# EAGLE design wireless_haptics (EAGLE 6.5.0)
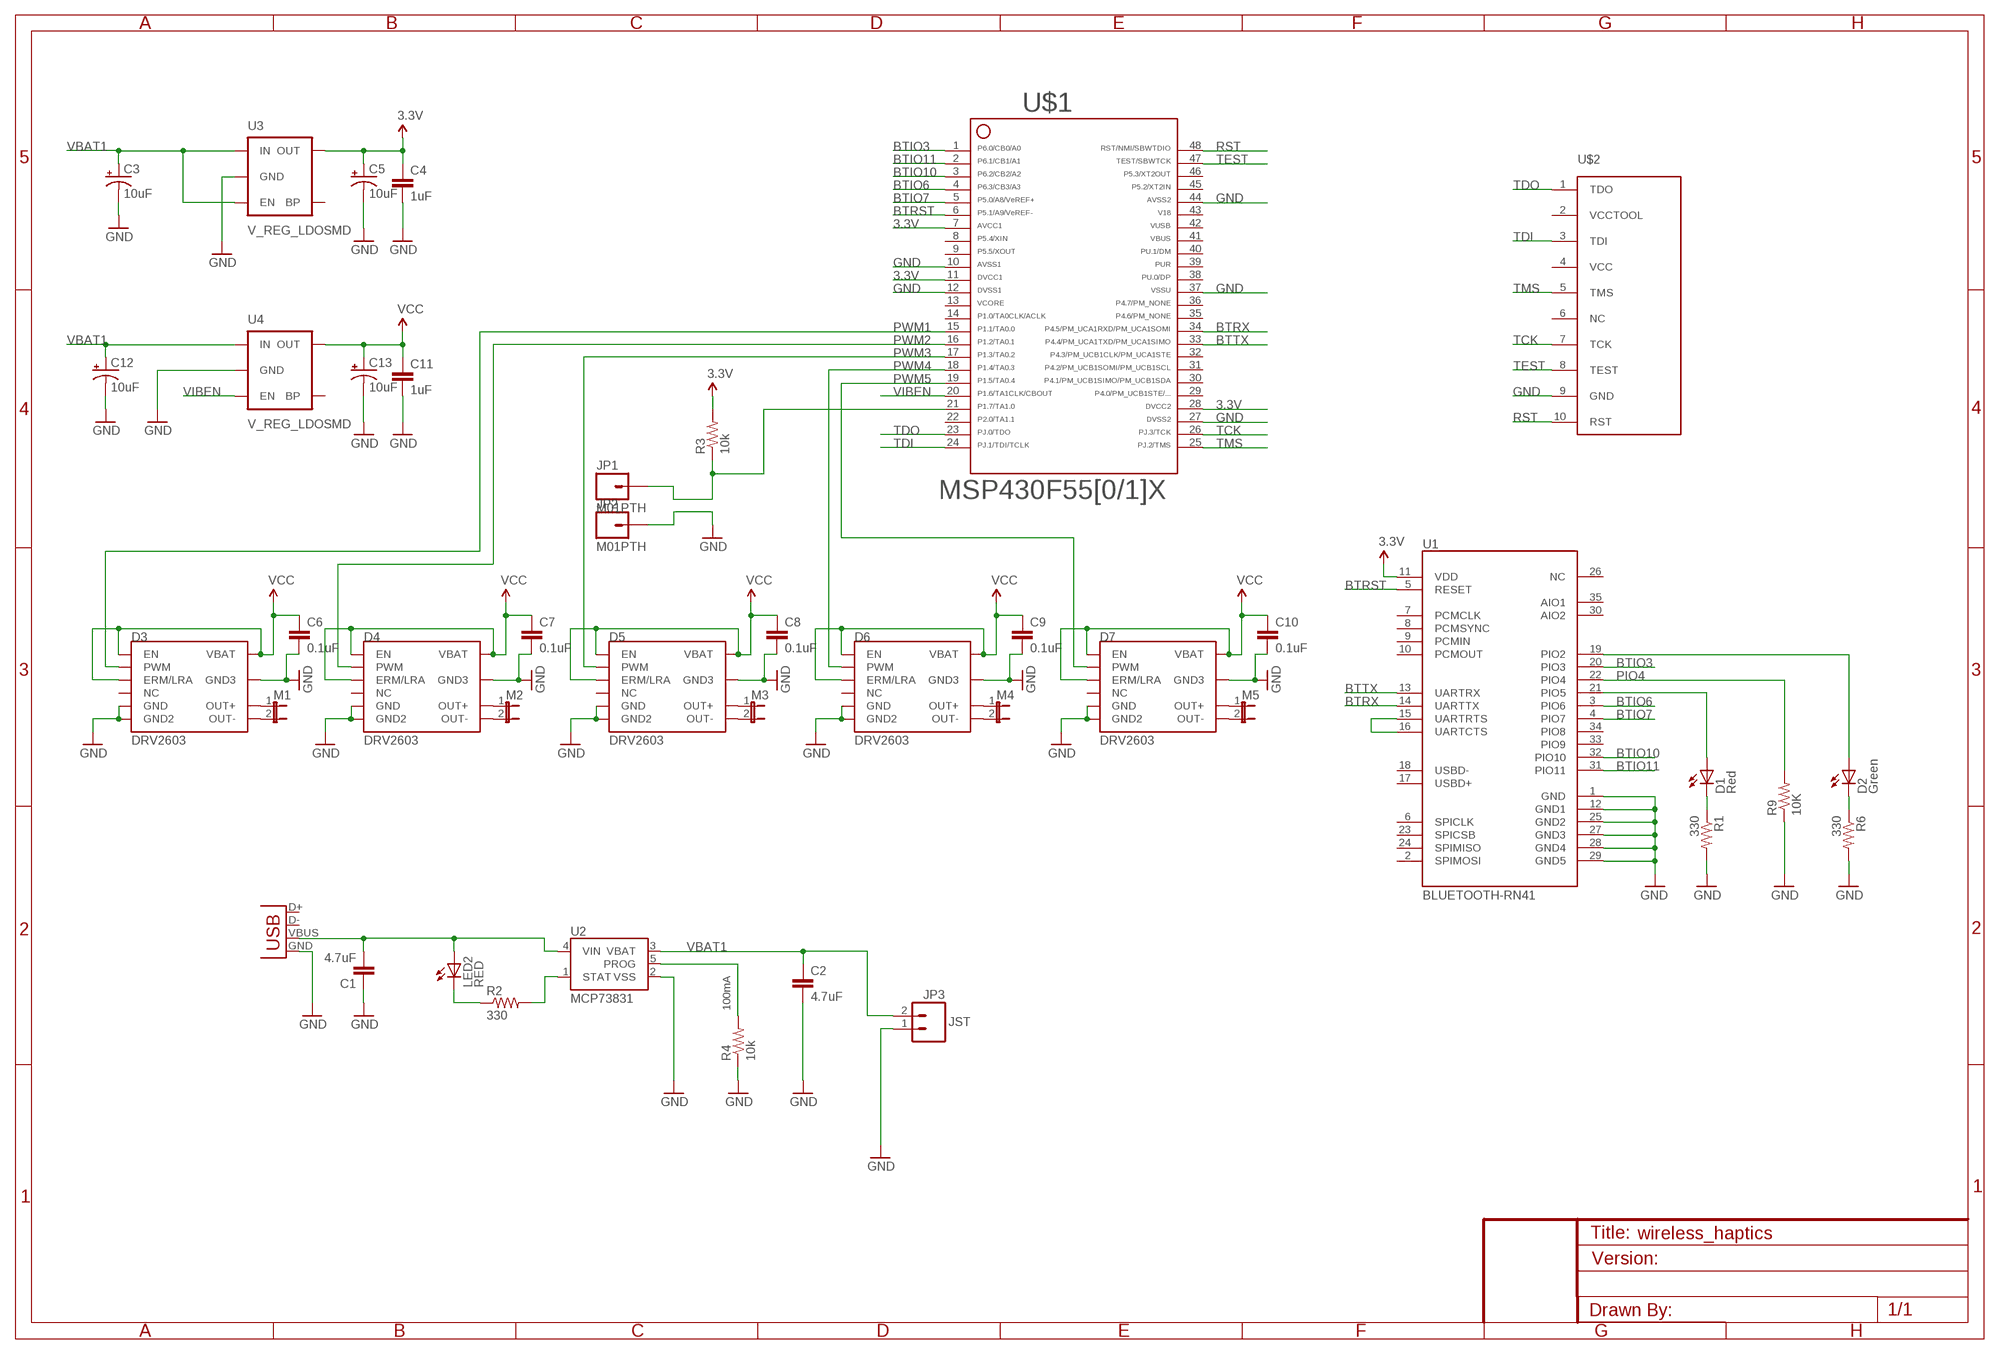
[diagram p0: schematic, sheet 1]

## Parts
C1  4.7uF  CAP0402-CAP  [0402-CAP]
C2  4.7uF  CAP0402-CAP  [0402-CAP]
C3  10uF  CAP_POL1206  [EIA3216]
C4  1uF  CAP0402-CAP  [0402-CAP]
C5  10uF  CAP_POL1206  [EIA3216]
C6  0.1uF  CAP0805  [0805]
C7  0.1uF  CAP0805  [0805]
C8  0.1uF  CAP0805  [0805]
C9  0.1uF  CAP0805  [0805]
C10  0.1uF  CAP0805  [0805]
C11  1uF  CAP0402-CAP  [0402-CAP]
C12  10uF  CAP_POL1206  [EIA3216]
C13  10uF  CAP_POL1206  [EIA3216]
D1  Red  LED0603  [LED-0603]
D2  Green  LED0603  [LED-0603]
D3  DRV2603  [QFN]
D4  DRV2603  [QFN]
D5  DRV2603  [QFN]
D6  DRV2603  [QFN]
D7  DRV2603  [QFN]
JP1  M01PTH  [1X01]
JP2  M01PTH  [1X01]
JP3  JST  M02JST-PTH-2  [JST-2-PTH]
LED2  RED  LED0603  [LED-0603]
M1  JUMPER-2PTH  [1X02]
M2  JUMPER-2PTH  [1X02]
M3  JUMPER-2PTH  [1X02]
M4  JUMPER-2PTH  [1X02]
M5  JUMPER-2PTH  [1X02]
R1  330  RESISTOR0402-RES  [0402-RES]
R2  330  RESISTOR0402-RES  [0402-RES]
R3  10k  RESISTOR0402-RES  [0402-RES]
R4  10k  RESISTOR0402-RES  [0402-RES]
R6  330  RESISTOR0402-RES  [0402-RES]
R9  10K  RESISTOR0402-RES  [0402-RES]
U1  BLUETOOTH-RN41  BLUETOOTH-RN41"  [RN41]
U2  MCP73831  [SOT23-5]
U3  V_REG_LDOSMD  [SOT23-5]
U4  V_REG_LDOSMD  [SOT23-5]
U$1  F55[0/1]X---PT48  [PT48]
U$2  TC2050-NL-MCP-NL  [TC2030-MCP-NL]
X1  USBSMD  [USB-MINIB]

## Nets
3.3V: C4.1 C5.A(+) U1.11(VDD) U3.5(OUT) U$1.7 U$1.11 U$1.28
BTIO3: U1.20(PIO3) U$1.1
BTIO6: U1.3(PIO6) U$1.4
BTIO7: U1.4(PIO7) U$1.5
BTIO10: U1.32(PIO10) U$1.3
BTIO11: U1.31(PIO11) U$1.2
BTRST: U1.5(RESET) U$1.6
BTRX: U1.14(UARTTX) U$1.34
BTTX: U1.13(UARTRX) U$1.33
D1: D1.C R1.1
D2: D2.C R6.1
GND: C1.1 C2.2 C3.C(-) C4.2 C5.C(-) C6.2 C7.2 C8.2 C9.2 C10.2 C11.2 C12.C(-) C13.C(-) D3.P$5(GND) D3.P$8(GND2) D3.P$10(GND3) D4.P$5(GND) D4.P$8(GND2) D4.P$10(GND3) D5.P$5(GND) D5.P$8(GND2) D5.P$10(GND3) D6.P$5(GND) D6.P$8(GND2) D6.P$10(GND3) D7.P$5(GND) D7.P$8(GND2) D7.P$10(GND3) JP2.1 JP3.1 R1.2 R4.1 R6.2 R9.1 U1.1(GND) U1.12(GND1) U1.25(GND2) U1.27(GND3) U1.28(GND4) U1.29(GND5) U2.2(VSS) U3.2(GND) U4.2(GND) U$1.10 U$1.12 U$1.27 U$1.37 U$1.44 U$2.9(GND) X1.GND
N$1: D1.A U1.21(PIO5)
N$2: D2.A U1.19(PIO2)
N$3: C1.2 LED2.A U2.4(VIN) X1.VBUS
N$4: D6.P$6(OUT+) M4.1
N$5: R2.2 U2.1(STAT)
N$6: LED2.C R2.1
N$7: D6.P$9(OUT-) M4.2
N$8: D7.P$6(OUT+) M5.1
N$9: D7.P$9(OUT-) M5.2
N$10: D5.P$6(OUT+) M3.1
N$11: D5.P$9(OUT-) M3.2
N$12: D4.P$6(OUT+) M2.1
N$13: D4.P$9(OUT-) M2.2
N$14: D3.P$6(OUT+) M1.1
N$15: D3.P$9(OUT-) M1.2
N$16: U1.15(UARTRTS) U1.16(UARTCTS)
N$18: JP1.1 R3.1 U$1.21
PIO4: R9.2 U1.22(PIO4)
PROG: R4.2 U2.5(PROG)
PWM1: D3.P$2(PWM) U$1.15
PWM2: D4.P$2(PWM) U$1.16
PWM3: D5.P$2(PWM) U$1.17
PWM4: D6.P$2(PWM) U$1.18
PWM5: D7.P$2(PWM) U$1.19
RST: U$1.48 U$2.10(RST)
TCK: U$1.26 U$2.7(TCK)
TDI: U$1.24 U$2.3(TDI)
TDO: U$1.23 U$2.1(TDO)
TEST: U$1.47 U$2.8(TEST)
TMS: U$1.25 U$2.5(TMS)
VBAT1: C2.1 C3.A(+) C12.A(+) JP3.2 U2.3(VBAT) U3.1(IN) U3.3(EN) U4.1(IN)
VCC: C6.1 C7.1 C8.1 C9.1 C10.1 C11.1 C13.A(+) D3.P$1(EN) D3.P$3(ERM/LRA) D3.P$7(VBAT) D4.P$1(EN) D4.P$3(ERM/LRA) D4.P$7(VBAT) D5.P$1(EN) D5.P$3(ERM/LRA) D5.P$7(VBAT) D6.P$1(EN) D6.P$3(ERM/LRA) D6.P$7(VBAT) D7.P$1(EN) D7.P$3(ERM/LRA) D7.P$7(VBAT) R3.2 U4.5(OUT) ; supply symbol labelled 3.3V
VIBEN: U4.3(EN) U$1.20
Unconnected: D3.P$4(NC) D4.P$4(NC) D5.P$4(NC) D6.P$4(NC) D7.P$4(NC) U1.2(SPIMOSI) U1.6(SPICLK) U1.7(PCMCLK) U1.8(PCMSYNC) U1.9(PCMIN) U1.10(PCMOUT) U1.17(USBD+) U1.18(USBD-) U1.23(SPICSB) U1.24(SPIMISO) U1.26(NC) U1.30(AIO2) U1.33(PIO9) U1.34(PIO8) U1.35(AIO1) U3.4(BP) U4.4(BP) U$1.8 U$1.9 U$1.14 U$1.22 U$1.29 U$1.30 U$1.31 U$1.32 U$1.35 U$1.36 U$1.38 U$1.39 U$1.40 U$1.45 U$2.2(VCCTOOL) U$2.4(VCC) U$2.6(NC) X1.D+ X1.D-

## Notes on the sheet
- 100mA

## Power pins joined to a net without a drawn wire
13: U$1.13
41: U$1.41
42: U$1.42
43: U$1.43
46: U$1.46

## Library data of the parts
C1 C2 C4 C6-C11 = SparkFun:CAP: Capacitor Standard 0603 ceramic capacitor, and 0.1" leaded capacitor.
C3 C5 C12 C13 = SparkFun:CAP_POL: Capacitor Polarized These are standard SMD and PTH capacitors. Normally 10uF, 47uF, and 100uF in electrolytic and tantalum varieties. Always verify the external diameter of the through hole cap, it varies with capacity, voltage, and manufacturer. The EIA devices should be standard.
D1 D2 LED2 = SparkFun:LED: LEDs Standard schematic elements and footprints for 5mm, 3mm, 1206, and 0603 sized LEDs. 5mm - Spark Fun Electronics SKU : COM-00529 (and others)
D3-D7 = drv10:DRV2603
JP1 JP2 = SparkFun-Connectors:M01: Header 1 Standard 1-pin 0.1" header. Use with straight break away headers (SKU : PRT-00116), right angle break away headers (PRT-00553), swiss pins (PRT-00743), machine pins (PRT-00117), and female headers (PRT-00115).
JP3 = SparkFun:M02: Header 2 Standard 2-pin 0.1" header. Use with straight break away headers (SKU : PRT-00116), right angle break away headers (PRT-00553), swiss pins (PRT-00743), machine pins (PRT-00117), and female headers (PRT-00115). Molex polarized connector foot print use with SKU : PRT-08233 with associated crimp pins and housings.
M1-M5 = SparkFun:JUMPER-2: Jumper Basic 0.1" spaced jumper. Use with breakaway headers.
R1-R4 R6 R9 = SparkFun:RESISTOR: Resistor Basic schematic elements and footprints for 0603, 1206, and PTH resistors.
U1 = ScratchPad:BLUETOOTH-RN41
U2 = SparkFun:MCP73831: Microchip's MCP73831 Miniature single cell, fully integrated Li-Ion, Li-polymer charge management controller http://ww1.microchip.com/downloads/en/DeviceDoc/21984a.pdf
U3 U4 = SparkFun:V_REG_LDO: Voltage Regulator LDO Standard 150mA LDO voltage regulator in SOT-23 layout. Micrel part MIC5205. BP (by-pass) pin is used to lower output noise with 470pF cap.
U$1 = MSP430-Eagle-Library:F55[0/1]X---PT48: ***F55[0/1/2]X*** PT48 Rev. 1.0 06/2010 "http://www.ti.com/lit/gpn/msp430f5509" Only for FF5504, F5508,F5509,F5510
U$2 = TC2050:TC2050-NL: TAG-CONNECT ISP Connector Manufacturer: Tag-Connect <www.tag-connect.com> Cable for easy In-Circuit PCB Programming. Designed for JTAG 10 pin, suitable for many others. Pin Connection for TC2050 NL. PAD Description 1 VTREF 2 TMS 3 GND 4 TCK 5 NC 6 TDO 7 RTCK 8 TDI 9 !TRST 10 RESET ©2009 ROFA.cz Modified 7/2011 by Tim McCarthy-Smith VIDA Products INC
X1 = SparkFun:USB: USB Connectors USB-B-PTH is fully proven SKU : PRT-00139 USB-miniB is fully proven SKU : PRT-00587 USB-A-PCB is untested. USB-A-H is throughly reviewed, but untested. Spark Fun Electronics SKU : PRT-00437 USB-B-SMT is throughly reviewed, but untested. Needs silkscreen touching up. USB-A-S has not been used/tested USB-MB-H has not been used/tested

## Board
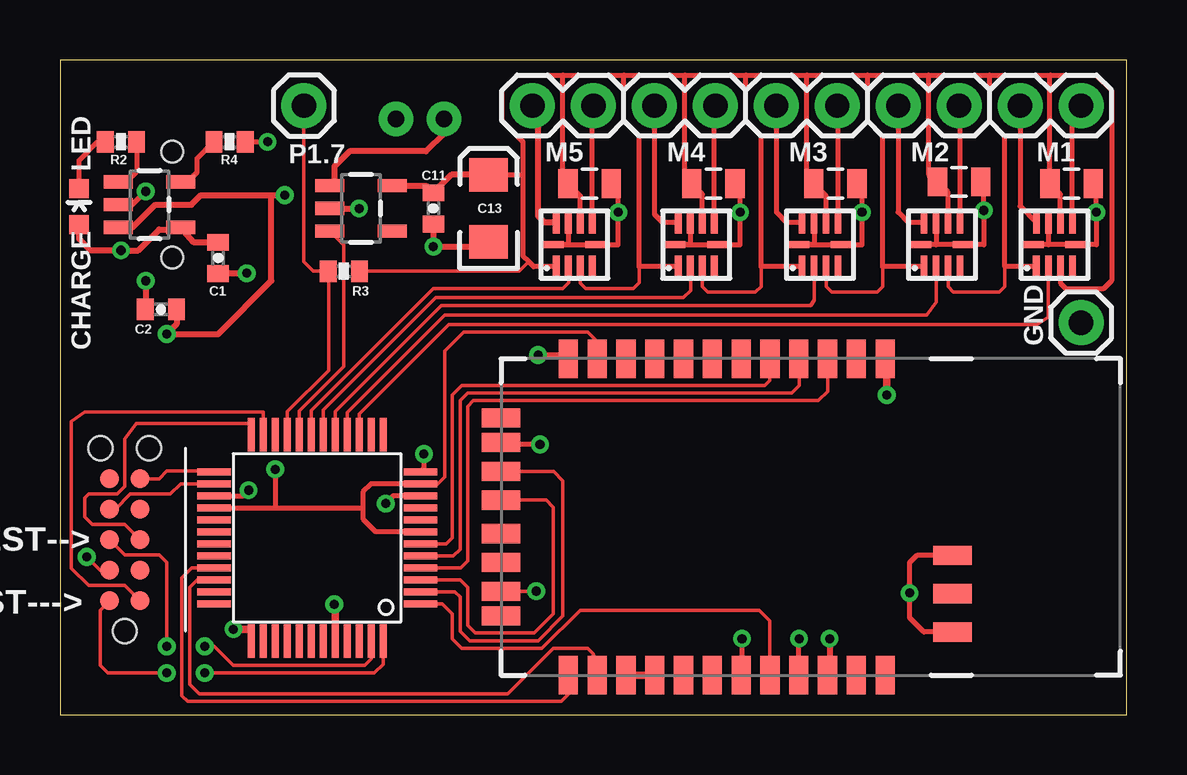
[diagram p1: board, top side]
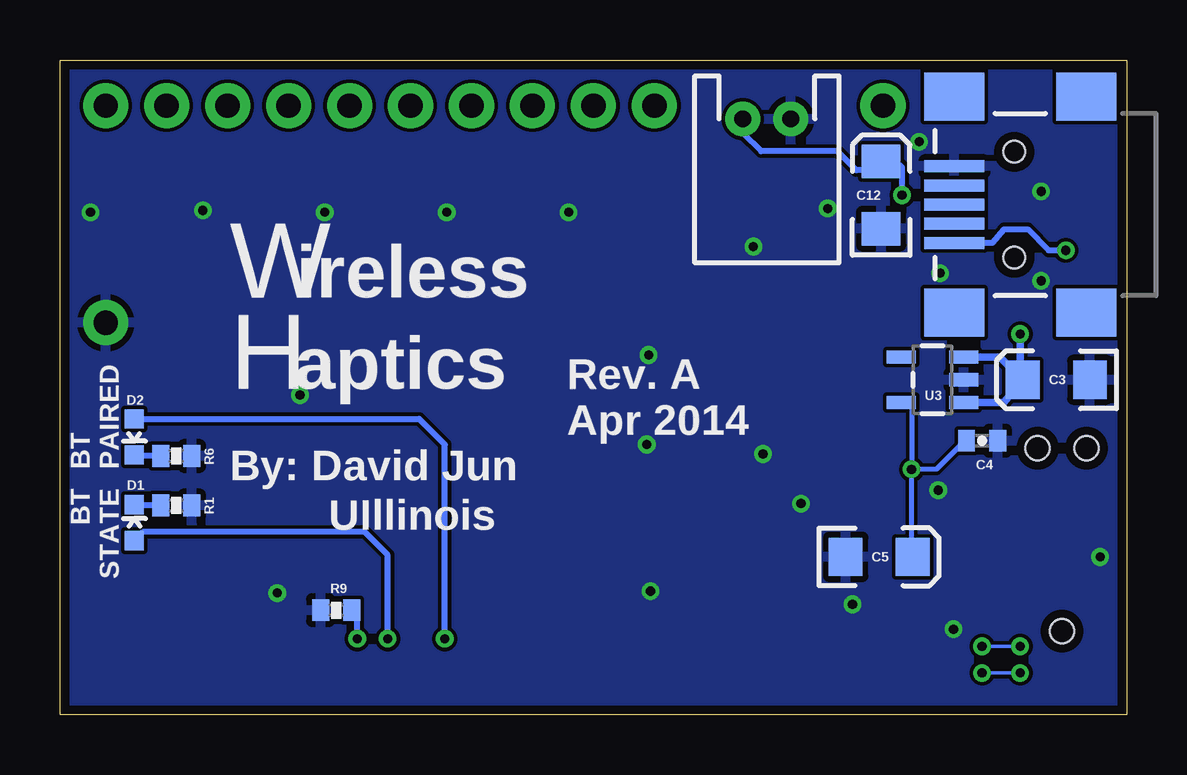
[diagram p2: board, bottom side, seen from below]

Size 44.45 x 27.3 mm. Coordinates in mm from the lower left corner, seen from the top.
Outline: 0,0 44.45,0 44.45,27.3 0,27.3 0,0
Copper layers (1*16): Top 0.0356mm / dielectric 1.5011mm / Bottom 0.0356mm
Design rules "LaenPCBOrder *": minimum track width 6mil, minimum drill 13mil, track to track 6mil, track to pad 6mil, pad to pad 6mil, via to via 6mil, smd to smd 6mil, copper to edge 15mil, drill to drill 6mil, minimum pad ring 7mil, minimum via ring 7mil, stop-mask expansion 3mil, vias tented up to drill 0mil, thermal gap 10mil

### Footprints (pad centres in the part's own frame; a part is rotated, then mirrored left to right if it is on the bottom)
0402-CAP = smd 0.7 x 0.9: 1 -0.65,0; 2 0.65,0
EIA3216 = smd 1.4 x 1.6: A 1.4,0; C -1.4,0
0805 = smd 0.8 x 1.2: 1 -0.9,0; 2 0.9,0
LED-0603 = smd 0.8 x 0.8: A 0,-0.75; C 0,0.75
QFN = smd 0.28 x 0.95: P$1 -0.753,-0.925; P$2 -0.25,-0.925; P$3 0.25,-0.925; P$4 0.75,-0.925; P$6 0.75,0.925; P$7 0.25,0.925; P$8 -0.25,0.925; P$9 -0.75,0.925 | smd 0.95 x 0.28: P$5 0.925,0; P$10 -0.925,0
1X01 = drill 1.016 pad 1.88: 1 0,0
JST-2-PTH = drill 0.7 pad 1.448: 1 -1,0; 2 1,0
1X02 = drill 1.016 pad 1.88: 1 0,0; 2 2.54,0
0402-RES = smd 0.7 x 0.9: 1 -0.65,0; 2 0.65,0
RN41 = smd 0.8 x 1.6: 1 -6.6,-6.6; 2 -5.4,-6.6; 3 -4.2,-6.6; 4 -3,-6.6; 5 -1.8,-6.6; 6 -0.6,-6.6; 7 0.6,-6.6; 8 1.8,-6.6; 9 3,-6.6; 10 4.2,-6.6; 11 5.4,-6.6; 12 6.6,-6.6; 13 6.6,6.6; 14 5.4,6.6; 15 4.2,6.6; 16 3,6.6; 17 1.8,6.6; 18 0.6,6.6; 19 -0.6,6.6; 20 -1.8,6.6; 21 -3,6.6; 22 -4.2,6.6; 23 -5.4,6.6; 24 -6.6,6.6 | smd 1.6 x 0.8: 25 -9.4,4.8; 26 -9.4,3.2; 27 -9.4,1.6; 28 9.4,3.1; 29 9.4,-3.1; 30 9.4,-4.122; 31 9.4,-1.9; 32 9.4,-0.7; 33 9.4,0.7; 34 9.4,1.9; 35 9.4,4.122
SOT23-5 = smd 0.55 x 1.2: 1 -0.95,-1.3; 2 0,-1.3; 3 0.95,-1.3; 4 0.95,1.3; 5 -0.95,1.3
PT48 = smd 1.4 x 0.3: 1 -4.3,2.75; 2 -4.3,2.25; 3 -4.3,1.75; 4 -4.3,1.25; 5 -4.3,0.75; 6 -4.3,0.25; 7 -4.3,-0.25; 8 -4.3,-0.75; 9 -4.3,-1.25; 10 -4.3,-1.75; 11 -4.3,-2.25; 12 -4.3,-2.75; 25 4.3,-2.75; 26 4.3,-2.25; 27 4.3,-1.75; 28 4.3,-1.25; 29 4.3,-0.75; 30 4.3,-0.25; 31 4.3,0.25; 32 4.3,0.75; 33 4.3,1.25; 34 4.3,1.75; 35 4.3,2.25; 36 4.3,2.75 | smd 0.3 x 1.4: 13 -2.75,-4.3; 14 -2.25,-4.3; 15 -1.75,-4.3; 16 -1.25,-4.3; 17 -0.75,-4.3; 18 -0.25,-4.3; 19 0.25,-4.3; 20 0.75,-4.3; 21 1.25,-4.3; 22 1.75,-4.3; 23 2.25,-4.3; 24 2.75,-4.3; 37 2.75,4.3; 38 2.25,4.3; 39 1.75,4.3; 40 1.25,4.3; 41 0.75,4.3; 42 0.25,4.3; 43 -0.25,4.3; 44 -0.75,4.3; 45 -1.25,4.3; 46 -1.75,4.3; 47 -2.25,4.3; 48 -2.75,4.3
TC2030-MCP-NL = smd 0.787 x 0.787: 1 1.27,-0.635; 2 2.54,-0.635; 3 3.81,-0.635; 4 5.08,-0.635; 5 6.35,-0.635; 6 6.35,0.635; 7 5.08,0.635; 8 3.81,0.635; 9 2.54,0.635; 10 1.27,0.635 | hole 1: 0,0; 7.62,-1.016; 7.62,1.016
USB-MINIB = smd 2.5 x 0.5: D+ 2.5,0; D- 2.5,0.8; GND 2.5,-1.6; ID 2.5,-0.8; VBUS 2.5,1.6 | smd 2.5 x 2: MTN1 -3,4.5; MTN2 2.5,4.5; MTN3 -3,-4.5; MTN4 2.5,-4.5 | hole 0.9: 0,2.2; 0,-2.2

### Placement (x,y rotation side)
C1  6.59,19.05 90 top
C2  4.21,16.91 180 top
C3  2.94,13.97 180 bottom
C4  6.03,11.43 0 bottom
C5  10.32,6.59 0 bottom
C6  42.15,22.15 0 top
C7  37.47,22.23 0 top
C8  32.31,22.15 0 top
C9  27.23,22.15 0 top
C10  22.07,22.15 0 top
C11  15.56,21.11 270 top
C12  10.24,21.67 90 bottom
C13  17.86,21.11 90 top
D1  41.35,8.02 0 bottom
D2  41.35,11.59 180 bottom
D3  41.43,19.61 0 top
D4  36.75,19.61 0 top
D5  31.67,19.61 0 top
D6  26.51,19.61 0 top
D7  21.43,19.61 0 top
JP1  10.16,25.4 0 top
JP2  42.55,16.35 0 top
JP3  15,24.84 180 bottom
LED2  0.79,21.19 0 top
M1  42.55,25.4 180 top
M2  37.47,25.4 180 top
M3  32.38,25.4 180 top
M4  27.3,25.4 180 top
M5  22.23,25.4 180 top
R1  39.61,8.73 0 bottom
R2  2.54,23.89 0 top
R3  11.83,18.49 0 top
R4  7.06,23.89 180 top
R6  39.61,10.79 0 bottom
R9  32.94,4.37 0 bottom
U1  27.78,8.26 180 top
U2  3.73,21.27 270 top
U3  8.1,13.97 90 bottom
U4  12.54,21.11 270 top
U$1  10.72,7.38 180 top
U$2  2.7,3.49 90 top
X1  4.68,21.27 180 bottom

### Tracks (layer width: path | path; a pad name or v marks a point on that pad's centre or on a via)
3.3V  (via drill 0.38)
  Top 0.152: U$1.11 15.74,9.63 16.03,9.92 16.03,15.16 16.83,15.95 21.99,15.95 22.38,15.56 U1.11
  Top 0.203: U$1.11 12.97,9.63 12.62,9.29 12.62,8.65 | 12.62,8.65 12.62,8.18 13.16,7.63 U$1.7 | U$1.28 8.97,8.63 | 8.97,8.63 12.6,8.63 12.62,8.65 | v8.97,10.24 8.97,8.63
  Bottom 0.152: U3.5 8.97,13.02
  Bottom 0.203: 6.92,11.26 7.94,10.24 v8.97,10.24 | 8.97,13.02 v8.97,10.24 | U3.5 9.4,13.21 | C5.A 8.97,6.64 v8.97,10.24
  Bottom 0.254: 6.92,11.26 6.86,11.26 C4.1
BTIO3
  Top 0.152: U1.20 29.58,3.92 29.13,4.37 21.67,4.37 20.08,2.78 16.75,2.78 16.35,3.17 16.35,4.21 15.93,4.63 U$1.1
BTIO6
  Top 0.152: U1.3 31.98,13.49 31.59,13.1 17.22,13.1 16.99,12.86 16.99,6.43 16.69,6.13 U$1.4
BTIO7
  Top 0.152: U1.4 30.8,14.84 30.8,13.73 30.48,13.41 16.99,13.41 16.67,13.1 16.67,6.91 16.39,6.63 U$1.5
BTIO10
  Top 0.152: U1.32 20.25,8.96 20.56,8.65 20.56,4.21 19.76,3.41 17.3,3.41 16.99,3.73 16.99,5.32 16.67,5.63 U$1.3
BTIO11
  Top 0.152: U$1.2 16.46,5.13 16.67,4.92 16.67,3.49 17.07,3.1 19.92,3.1 20.95,4.13 20.95,9.76 20.56,10.15 U1.31
  Top 0.203: 18.22,10.16 U1.31
BTRST
  Top 0.152: U1.5 29.58,13.94 29.37,13.73 16.75,13.73 16.35,13.34 16.35,7.38 16.1,7.13 U$1.6
BTRX
  Top 0.152: U1.14 22.22,2.54 21.99,2.78 20.56,2.78 18.65,0.87 5.79,0.87 5.4,1.27 5.4,5.32 5.71,5.63 U$1.34
BTTX
  Top 0.152: U$1.33 5.5,6.13 5.08,5.71 5.08,0.79 5.32,0.56 20.88,0.56 21.19,0.87 21.19,1.64 U1.13
D1
  Bottom 0.254: R1.1 41.32,8.73 D1.C
D2
  Bottom 0.254: R6.1 41.31,10.79 D2.C
GND  (via drill 0.38)
  Top 0.152: v19.84,5.16 19.68,5.16 U1.28 | U$2.9 1.67,6.03 v1.11,6.59
  Top 0.203: U$1.10 13.89,9.13 v13.57,8.81 | v15.16,10.87 15.16,10.28 U$1.12 | v20,11.27 18.31,11.27 U1.29 | 21.18,15.56 U1.12 | U1.25 35.99,3.46 35.4,4.05 v35.4,5.08 35.4,6.35 35.72,6.67 37.17,6.67 U1.27 | C6.2 43.18,22.01 v43.18,20.95 43.18,19.61 D3.P$5 41.18,19.61 | D3.P$8 41.18,19.61 | 41.18,19.61 D3.P$10 | C7.2 38.5,22.09 v38.5,21.03 38.5,19.61 D4.P$5 D4.P$10 36.5,19.61 D4.P$8 | D5.P$8 31.42,19.61 D5.P$10 D5.P$5 33.42,19.61 v33.42,20.95 33.42,21.93 C8.2 | D6.P$8 26.26,19.61 D6.P$10 D6.P$5 28.34,19.61 v28.34,20.95 28.34,21.93 C9.2 | D7.P$8 21.18,19.61 D7.P$10 D7.P$5 23.26,19.61 v23.26,20.95 23.26,21.86 C10.2 | U$1.27 7.62,9.13 v7.86,9.37 | R4.1 v8.65,23.89 | v3.57,21.83 3.02,21.27 U2.2
  Top 0.254: 3.33,16.68 C2.2 | 3.33,17.13 C2.2 | C11.2 v15.56,19.53 17.67,19.53 C13.C | U4.2 v12.46,21.11 | v3.57,18.1 3.57,16.92 C2.2 | C1.1 7.05,18.41 v7.78,18.41 | v19.92,15 21.03,15 U1.12
  Top 0.305: v34.45,13.34 34.45,14.92 U1.1 | v7.22,3.57 7.97,3.57 U$1.37 | U$1.44 11.47,4.57 v11.43,4.6
  pour Bottom: 0,0 0,27.3 44.69,27.23 44.69,-0.08
N$1  (via drill 0.38)
  Top 0.203: U1.21 30.78,3.16 v30.8,3.17
  Bottom 0.254: v30.8,3.17 30.8,6.67 31.75,7.62 41,7.62 D1.A
N$2  (via drill 0.38)
  Top 0.203: v28.42,3.17 28.42,1.69 U1.19
  Bottom 0.254: v28.42,3.17 28.42,11.27 29.48,12.34 D2.A
N$3  (via drill 0.38)
  Top 0.254: 5.03,20.24 U2.4 | U2.4 5.03,20.24 4.13,20.24 3.25,19.37 v2.54,19.37 1.27,19.37 0.79,19.84 LED2.A | C1.2 5.57,19.7 U2.4
  Bottom 0.254: X1.VBUS 6.35,19.67 | 6.35,19.67 6.04,19.67 | 6.35,19.67 6.34,19.68 5.59,19.68 5.11,20.24 4.13,20.24 3.25,19.37 v2.54,19.37
N$4
  Top 0.203: D6.P$6 27.26,25.36 M4.1
N$5
  Top 0.203: R2.2 3.19,22.64 2.78,22.22 U2.1
N$6
  Top 0.203: LED2.C 0.79,23.11 1.57,23.89 R2.1
N$7
  Top 0.203: M4.2 24.77,20.88 25.11,20.53 D6.P$9
N$8
  Top 0.203: D7.P$6 22.18,25.36 M5.1
N$9
  Top 0.254: D7.P$9 20.19,20.53 19.92,20.8 19.92,25.16 M5.2
N$10
  Top 0.203: D5.P$6 32.42,25.36 M3.1
N$11
  Top 0.203: M3.2 29.84,20.95 30.27,20.53 D5.P$9
N$12
  Top 0.203: D4.P$6 37.5,25.36 M2.1
N$13
  Top 0.203: M2.2 34.92,20.95 35.35,20.53 D4.P$9
N$14
  Top 0.203: D3.P$6 42.18,25.04 M1.1
N$15
  Top 0.203: M1.2 40.01,21.21 D3.P$9
N$16
  Top 0.305: U1.15 U1.16
N$18
  Top 0.152: U$1.21 9.47,12.64 11.19,14.37 11.19,18.08 R3.1 10.56,18.49 10.16,18.89 JP1.1
PIO4  (via drill 0.38)
  Top 0.254: v32.07,3.17 32.07,1.74 U1.22
  Bottom 0.254: v32.07,3.17 32.07,4.14 R9.2
PROG
  Top 0.203: U2.5 5.24,22.14 5.71,22.62 5.71,23.19 R4.2
PWM1
  Top 0.152: D3.P$2 41.18,16.58 40.72,16.27 16.19,16.27 12.47,12.54 U$1.15
PWM2
  Top 0.152: D4.P$2 36.5,17.21 36.12,16.67 16.03,16.67 11.97,12.6 U$1.16
PWM3
  Top 0.152: D5.P$2 31.42,17.29 31.27,17.07 15.88,17.07 11.47,12.66 U$1.17
PWM4
  Top 0.152: U$1.18 10.97,12.71 15.66,17.4 25.98,17.4 26.27,17.7 26.27,18.67 D6.P$2
PWM5
  Top 0.152: U$1.19 10.47,12.69 15.56,17.78 20.95,17.78 21.19,18.02 21.19,18.67 D7.P$2
RST  (via drill 0.38)
  Top 0.152: v6.03,1.75 13.1,1.75 13.47,2.12 U$1.48 | v4.45,1.75 1.98,1.75 1.67,2.06 1.67,4.37 U$2.10
  Bottom 0.152: v6.03,1.75 v4.45,1.75
TCK
  Top 0.152: U$2.7 2.3,8.57 2.94,9.21 4.6,9.21 5.03,9.63 U$1.26
TDI
  Top 0.152: U$1.24 7.97,12.14 3.17,12.14 2.7,11.51 2.7,9.53 2.38,9.21 1.19,9.21 1.03,9.05 1.03,8.26 1.35,7.94 2.7,7.94 U$2.3
TDO
  Top 0.152: U$1.23 8.47,12.62 1.03,12.62 0.48,12.22 0.48,6.11 1.19,5.4 2.7,5.4 U$2.1
TEST  (via drill 0.38)
  Top 0.152: U$1.47 12.97,2.33 12.7,2.06 7.22,2.06 6.43,2.86 v6.03,2.86 | v4.45,2.86 4.45,6.35 4.13,6.67 2.7,6.67 U$2.8
  Bottom 0.152: v6.03,2.86 v4.45,2.86
TMS
  Top 0.152: U$2.5 4.13,9.84 4.45,10.16 6.39,10.16 U$1.25
VBAT1  (via drill 0.38)
  Top 0.254: JP3.2 16,24.26 15.24,23.5 12.06,23.5 11.43,22.86 11.43,22.25 U4.1 | C2.1 4.86,16.29 v4.45,15.88 6.59,15.88 8.81,18.1 8.81,21.59 8.89,21.67 | 8.89,21.67 5.87,21.67 5.48,21.27 3.97,21.27 3.02,20.32 U2.3 | 8.89,21.67 v9.37,21.67
  Bottom 0.254: 9.92,22.7 10.16,22.7 | 10.16,22.7 11.27,22.7 12.06,23.5 15.24,23.5 16,24.26 JP3.2 | 10.16,22.7 10.16,23.07 C12.A 9.6,23.07 9.37,22.83 v9.37,21.67
  Bottom 0.305: 4.71,14.34 C3.A 5.13,13.02 U3.1 | v4.45,15.88 4.45,14.61 4.71,14.34 | U3.3 5.29,14.92 4.71,14.34
VCC
  Top 0.152: D7.P$3 21.68,18.01 21.91,17.78 23.89,17.78 24.13,18.02 24.13,18.68 | D5.P$3 31.92,17.85 32.15,17.62 34.05,17.62 34.29,17.86 34.29,18.65 34.32,18.68 | D6.P$3 26.76,17.85 26.99,17.62 28.97,17.62 29.21,17.86 29.21,18.68 | D4.P$3 37,17.85 37.23,17.62 39.13,17.62 39.37,17.86 39.37,18.68 | R3.2 19.13,18.49 19.53,18.89
  Top 0.203: D3.P$7 41.68,21.71 C6.1 41.25,26.64 41.27,26.67 | 36.2,26.67 36.2,22.59 arc90 C7.1 37,21.79 D4.P$7 | 36.2,26.67 38.73,26.67 | 38.73,26.67 41.27,26.67 | 41.27,26.67 43.18,26.67 43.81,26.04 43.81,18.1 43.5,17.78 41.91,17.78 41.68,18.01 D3.P$3 | 38.73,26.67 38.73,24.77 39.37,24.13 39.37,18.68 D3.P$1 | D5.P$7 31.92,21.63 C8.1 31.11,22.44 31.11,26.67 | D6.P$7 26.76,21.71 C9.1 26.04,22.44 26.04,26.67 | D7.P$7 21.68,21.63 C10.1 20.95,22.36 20.95,26.67 | 31.11,26.67 33.66,26.67 | 33.66,26.67 36.2,26.67 | 28.57,26.67 28.57,24.77 29.21,24.13 29.21,18.68 D5.P$1 | 28.57,26.67 31.11,26.67 | 23.5,26.67 23.5,24.77 24.13,24.13 24.13,18.68 D6.P$1 25.76,18.97 | 23.5,26.67 26.04,26.67 | 26.04,26.67 28.57,26.67 | 20.95,26.67 23.5,26.67 | 20.95,26.67 19.05,26.67 18.41,26.04 18.41,24.77 19.29,23.89 19.29,22.51 | 33.66,26.67 33.66,24.77 34.29,24.13 34.29,18.68 | D7.P$1 19.74,18.68 19.53,18.89 19.29,19.13 19.29,22.51 | D4.P$1 34.29,18.68 | 34.29,18.65 34.29,18.68 | C13.A 19.29,22.51
  Top 0.254: U4.5 15.26,22.06 C11.1 16.31,22.51 C13.A
VIBEN
  Top 0.152: U$1.20 9.97,12.66 11.83,14.53 11.83,19.58 U4.3 | 10.95,20.16 U4.3 | 11.11,20.04 U4.3 | 11.43,19.98 U4.3

### Text on the board
tPlace: LED | P1.7 | CHARGE | GND | TEST--> | RST--->
bPlace: ireless | W | aptics | H | Rev. A / Apr 2014 | By: David Jun | BT / PAIRED | BT / STATE | UIllinois